# Altium schematic sheet 08_User_IO.SchDoc: User IO
size A; Revision: A; SheetNumber: 8; SheetTotal: 8; ECE315_Project_Name: ECE453 MCU Base Project
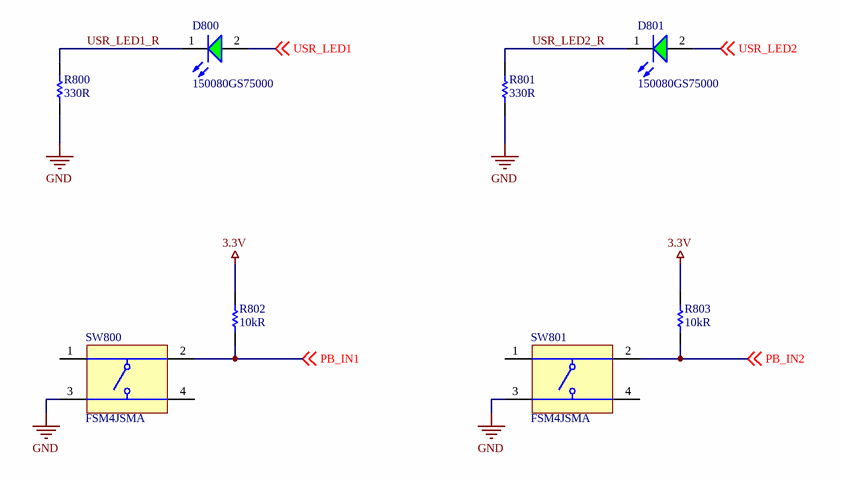
[diagram p0: 08_User_IO.SchDoc]

## Parts
D800  150080GS75000  [WL-SMCW_0805_150080xx75000]
D801  150080GS75000  [WL-SMCW_0805_150080xx75000]
R800  330R  [RESC2013X60X40LL20T25]
R801  330R  [RESC2013X60X40LL20T25]
R802  10kR  [RESC2013X70X40ML20T20]
R803  10kR  [RESC2013X70X40ML20T20]
SW800  FSM4JSMA  [TECO-FSM4JSMA_V]
SW801  FSM4JSMA  [TECO-FSM4JSMA_V]

## Nets
3.3V: R802.2 R803.2
GND: R800.2 R801.2 SW800.3 SW801.3
PB_IN1: R802.1 SW800.2 ; off-sheet PB_IN1
PB_IN2: R803.1 SW801.2 ; off-sheet PB_IN2
USR_LED1: D800.2(A) ; off-sheet USR_LED1
USR_LED1_R: D800.1(K) R800.1
USR_LED2: D801.2(A) ; off-sheet USR_LED2
USR_LED2_R: D801.1(K) R801.1

Not connected (* = marked no-connect by the designer): SW800 1 4; SW801 1 4

## Notes on the sheet
- Title:
- Size:
- A
- Project
- Rev:
- Sheet:
- of
- College of Engineering
- 1415 Engineering Drive
- Madison, WI 53706

## Library data of the parts
D800 D801 = CMP-1426-00007-2: NexarPartId: 29717780; Wavelength: 520nm; Forward Current: 100mA; Lens Style: Clear, Rectangular; Dominant Wavelength: 525nm; Max Junction Temperature (Tj): 95°C; Power Dissipation: 105mW; Luminous Intensity: 450mcd; Peak Wavelength: 515nm; Color: Green; Viewing Angle: 140°; Test Current: 20mA; Reverse Voltage: 5V; Forward Voltage: 3.2V; Mount: Surface Mount; REACH SVHC: Unknown; Min Operating Temperature: -40°C; Case Code (Imperial): 0805; Case/Package: 0805; Max Operating Temperature: 85°C; RoHS: Compliant; Length: 2mm; Height: 700µm; Width: 1.25mm; Case Code (Metric): 2012; Packaging: Tape and Reel; Max Reverse Voltage (DC): 5V
R800 R801 = CMP-2001-00628-1: Manufacturer: Panasonic; Part Number: ERA6AEB331V
R802 R803 = CMP-2001-04376-1: Manufacturer: Panasonic; Part Number: ERJ-6ENF1002V
SW800 SW801 = CMP-2000-05602-2: Swicth, SPST, 24 V, -35 to 85 degC, 4-Pin SMD, RoHS, Tape and Reel; Manufacturer: TE Connectivity; Switch Travel: 0.25mm; Mechanical Life: 100000Cycles; Contact Current Rating: 50mA; Operating Force: 1.57N; Actuator Material: Polyamide; Contact Resistance: 100mOhm; Voltage Rating: 24V; Illumination Type: Illuminated; Actuator Length: 0.055inch; Max Voltage Rating (DC): 12V; Case\/Package: SMD/SMT; Orientation: Straight; Datasheet URL: http://www.te.com/commerce/DocumentDelivery/DDEController?Action=showdoc&DocId=Customer+Drawing%7F2-1437565-7%7FV%7Fpdf%7FEnglish%7FENG_CD_2-1437565-7_V.pdf%7F4-1437565-2; Min Operating Temperature: -35degC; Packaging: LoosePiece; Termination: GullWing; Throw Configuration: SPST; Package Description: 4-Pin Surface Mount Device, Body 6 x 6 mm, Pitch 4.5 mm; Mounting Technology: SurfaceMount; Contact Plating: Silver; Datasheet Version: Rev. V, 02/2015; RoHSCompliant: true; Max Operating Temperature: 85degC; Length: 6mm; Voltage Rating (DC): 24V; Electrical Life: 100000Cycles; Current Rating: 50mA; Package Quantity: 750; Mount: SurfaceMount; Package Reference: FSM4JSMA; Manufacturer URL: http://www.te.com/; Width: 6mm; REACH SVHC: Unknown; Contact Material: CopperAlloy